# Altium project Motor42_Foc.PrjPcb
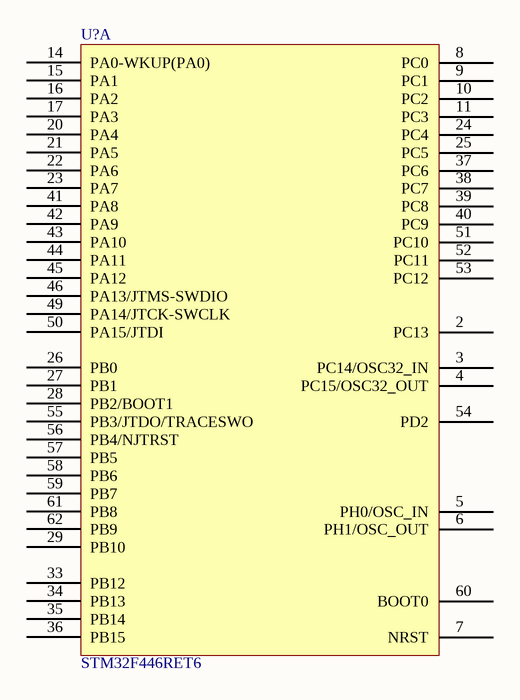
[diagram p0: MCU.SchDoc]
2 sheets, 19 parts. Net scope: flat (ports and power ports of the same name join across sheets).
Board file: Motor42_Foc.PcbDoc
Sheets:
  MCU.SchDoc
  MOTOR.SchDoc

## Sheet MCU.SchDoc
size A4; SheetNumber: 1; SheetTotal: 2

### Parts
(Parts that share a designator on the sheet are numbered #1, #2 ... from top to bottom, then left to right.)
U?#1  STM32F446RET6  [LQFP-64_10x10_P0.5]  (part A of 2)

### Nets

Not connected (* = marked no-connect by the designer): U?#1 2(PC13) 3(PC14/OSC32_IN) 4(PC15/OSC32_OUT) 5(PH0/OSC_IN) 6(PH1/OSC_OUT) 7(NRST) 8(PC0) 9(PC1) 10(PC2) 11(PC3) 14(PA0-WKUP(PA0)) 15(PA1) 16(PA2) 17(PA3) 20(PA4) 21(PA5) 22(PA6) 23(PA7) 24(PC4) 25(PC5) 26(PB0) 27(PB1) 28(PB2/BOOT1) 29(PB10) 33(PB12) 34(PB13) 35(PB14) 36(PB15) 37(PC6) 38(PC7) 39(PC8) 40(PC9) 41(PA8) 42(PA9) 43(PA10) 44(PA11) 45(PA12) 46(PA13/JTMS-SWDIO) 49(PA14/JTCK-SWCLK) 50(PA15/JTDI) 51(PC10) 52(PC11) 53(PC12) 54(PD2) 55(PB3/JTDO/TRACESWO) 56(PB4/NJTRST) 57(PB5) 58(PB6) 59(PB7) 60(BOOT0) 61(PB8) 62(PB9)

### Library data of the parts
U?#1 = STM32F446RET6: Suppiler: 立创商城; Suppiler Number: C69336; Vendor: ST(意法半导体); Component Type: STM32F446RET6; ComponentLink2Description: Datasheet; LatestRevisionDate: 2025-08-06

## Sheet MOTOR.SchDoc
size A4; SheetNumber: 2; SheetTotal: 2
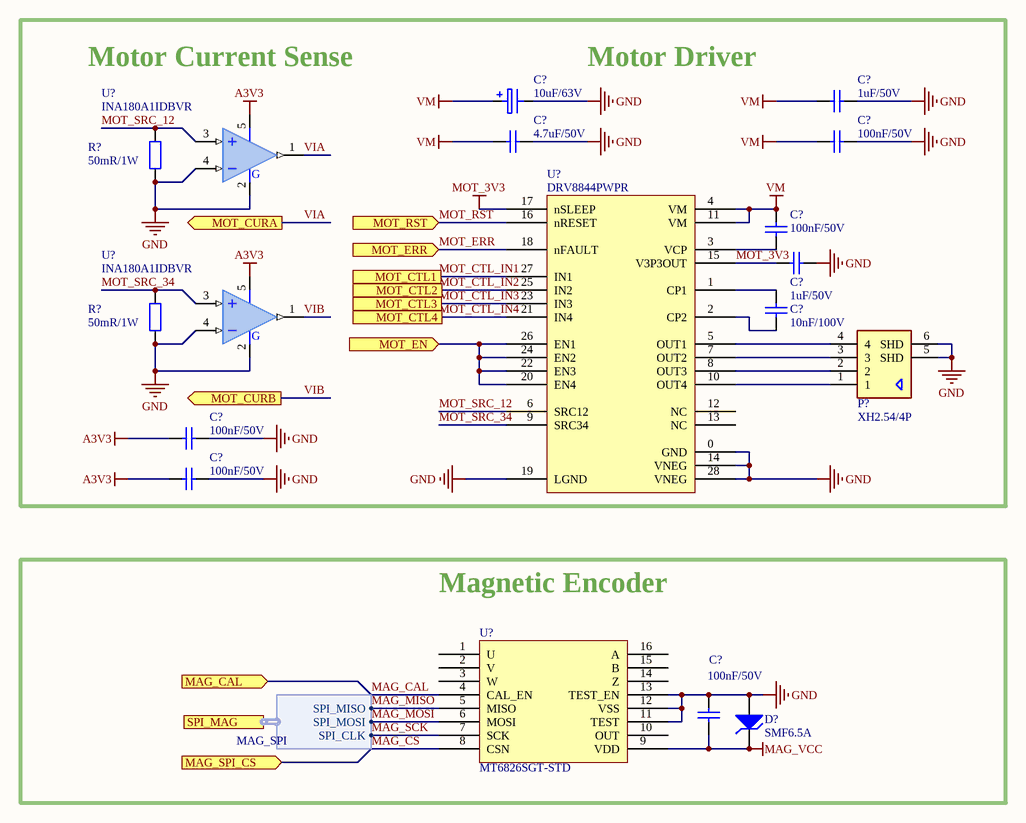
[diagram p1: MOTOR.SchDoc]

### Parts
(Parts that share a designator on the sheet are numbered #1, #2 ... from top to bottom, then left to right.)
C?#1  10uF/63V  [CAP_ELE_POLYMER_SMD_D6.3*L5.8]
C?#2  1uF/50V  [C1206]
C?#3  4.7uF/50V  [C1206]
C?#4  100nF/50V  [C0805]
C?#5  100nF/50V  [C0603]
C?#6  1uF/50V  [C0603]
C?#7  10nF/100V  [C0603]
C?#8  100nF/50V  [C0603]
C?#9  100nF/50V  [C0603]
C?#10  100nF/50V  [C0603]
D?  SMF6.5A  [SOD-123FL_TVS_UNI]
P?  XH2.54/4P  [XH2.54-4P_WT_SMT_L15.0*W7.8*H6.0]
R?#1  50mR/1W  [R1206]
R?#2  50mR/1W  [R1206]
U?#2  INA180A1IDBVR  [SOT-23-5]
U?#3  DRV8844PWPR  [TSSOP-28-EP_L9.8*W4.5_P0.65_EP5.62*2.94]
U?#4  INA180A1IDBVR  [SOT-23-5]
U?#5  MT6826SGT-STD  [TSSOP-16]

### Blocks framed on the sheet
Magnetic Encoder: C?#10 D? U?#5

### Ports
MAG_CAL (in), MAG_SPI_CS (in), MOT_CTL1 (in), MOT_CTL2 (in), MOT_CTL3 (in), MOT_CTL4 (in), MOT_CURA (out), MOT_CURB (out), MOT_EN (in), MOT_ERR (in), MOT_RST (in), SPI_MAG (harness MAG_SPI)

### Harnesses
MAG_SPI: SPI_MISO, SPI_MOSI, SPI_CLK

### Nets
A3V3: C?#8.1 C?#9.1 U?#2.5(VS) U?#4.5(VS)
GND: C?#1.2 C?#2.2 C?#3.2 C?#4.2 C?#6.1 C?#8.2 C?#9.2 C?#10.2 D?.1(ANODE) P?.5(SHD) P?.6(SHD) R?#1.1 R?#2.1 U?#2.2(GND) U?#2.4(IN-) U?#3.0(GND) U?#3.14(VNEG) U?#3.19(LGND) U?#3.28(VNEG) U?#4.2(GND) U?#4.4(IN-) U?#5.11(TEST) U?#5.12(VSS) U?#5.13(TEST_EN)
MAG_VCC: C?#10.1 D?.2(CATHODE) U?#5.9(VDD)
MOT_3V3: C?#6.2 U?#3.15(V3P3OUT) U?#3.17(nSLEEP)
VM: C?#1.1 C?#2.1 C?#3.1 C?#4.1 C?#5.1 U?#3.4(VM) U?#3.11(VM)
MAG_CAL: U?#5.4(CAL_EN) ; port MAG_CAL
MAG_CS: U?#5.8(CSN) ; port MAG_SPI_CS
MAG_MISO: U?#5.5(MISO) ; port SPI_MAG.SPI_MISO
MAG_MOSI: U?#5.6(MOSI) ; port SPI_MAG.SPI_MOSI
MAG_SCK: U?#5.7(SCK) ; port SPI_MAG.SPI_CLK
MOT_CTL_IN1: U?#3.27(IN1) ; port MOT_CTL1
MOT_CTL_IN2: U?#3.25(IN2) ; port MOT_CTL2
MOT_CTL_IN3: U?#3.23(IN3) ; port MOT_CTL3
MOT_CTL_IN4: U?#3.21(IN4) ; port MOT_CTL4
MOT_ERR: U?#3.18(nFAULT) ; port MOT_ERR
MOT_RST: U?#3.16(nRESET) ; port MOT_RST
MOT_SRC_12: R?#1.2 U?#2.3(IN+) U?#3.6(SRC12)
MOT_SRC_34: R?#2.2 U?#3.9(SRC34) U?#4.3(IN+)
VIA: U?#2.1(OUT) ; port MOT_CURA
VIB: U?#4.1(OUT) ; port MOT_CURB
NetC?#5_2: C?#5.2 U?#3.3(VCP)
NetC?#7_1: C?#7.1 U?#3.2(CP2)
NetC?#7_2: C?#7.2 U?#3.1(CP1)
NetP?_1: P?.1 U?#3.10(OUT4)
NetP?_2: P?.2 U?#3.8(OUT3)
NetP?_3: P?.3 U?#3.7(OUT2)
NetP?_4: P?.4 U?#3.5(OUT1)
NetU?#3_20: U?#3.20(EN4) U?#3.22(EN3) U?#3.24(EN2) U?#3.26(EN1) ; port MOT_EN

Not connected (* = marked no-connect by the designer): U?#3 12(NC) 13(NC); U?#5 1(U) 2(V) 3(W) 10(OUT) 14(Z) 15(B) 16(A)

### Notes on the sheet
- Motor Current Sense
- Motor Driver
- (in symbol INA180A1IDBVR) G

### Library data of the parts
C?#1 = HV1J106M0605PZ: Vendor: HONOR(荣誉); Tolerance: ±20%; Type: Polymer; Suppiler: 立创商城; Suppiler Number: C5246566; Published: 8-Jun-2000; LatestRevisionDate: 2025/8/11; LatestRevisionNote: Re-released for DXP Platform.; PackageReference: RB7.6-15; Publisher: Altium Limited; Value: 10uF/63V; Component Type: HV1J106M0605PZ; ComponentLink2Description: DataSheet
C?#2-C?#10 = Cap: Capacitor; Value: 0.1uF; Published: 8-Jun-2000; LatestRevisionDate: 17-Jul-2002; LatestRevisionNote: Re-released for DXP Platform.; PackageReference: RAD-0.3; Publisher: Altium Limited
D? = SMF6.5A: Vendor: Littelfuse(美国力特); Type: TVS; Suppiler: 立创商城; Suppiler Number: C720056; Component Type: SMF6.5A; ComponentLink2Description: DataSheet; LatestRevisionDate: 2025/8/7
P? = WAFER-XH2.54-4PWB: SMD,P=2.5mm,4P,卧贴; Vendor: XUNPU(讯普); Suppiler: 立创商城; Suppiler Number: C3029478; Component Type: WAFER-XH2.54-4PWB; Type: XH2.54/4P; ComponentLink2Description: DataSheet; LatestRevisionDate: 2025/8/8
R?#1 R?#2 = HoYH1206-1W-50mR-1%: Vendor: Milliohm(毫欧); Tolerance: ±1%; Suppiler: 立创商城; Suppiler Number: C601088; Published: 8-Jun-2000; LatestRevisionDate: 2025/8/11; LatestRevisionNote: Re-released for DXP Platform.; PackageReference: AXIAL-0.4; Publisher: Altium Limited; Value: 50mR/1W; Component Type: HoYH1206-1W-50mR-1%; Type: 1206/1W; ComponentLink2Description: DataSheet
U?#2 U?#4 = INA180A1IDBVR: low and high side voltage Output,Currrent Sense Amplifiers,Gain=20V/V.; Vendor: TI(德州仪器); Suppiler: 立创商城; Suppiler Number: C122228; Component Type: INA180A1IDBVR; Type: Current Sense Amplifiers; ComponentLink2Description: DataSheet; LatestRevisionDate: 2025/8/11
U?#3 = DRV8844PWPR: Quad 1/2 H-Bridge Driver IC; Vendor: TI(德州仪器); Suppiler: 立创商城; Suppiler Number: C177807; Component Type: DRV8844PWPR; ComponentLink2Description: DataSheet; LatestRevisionDate: 2025/8/8
U?#5 = MT6826SGT-STD: 15位高分辨率、高精度磁性角度编码器IC; Vendor: MagnTek（麦歌恩）; Suppiler: 立创商城; Suppiler Number: C27636731; Component Type: MT6826SGT-STD; ComponentLink2Description: DataSheet; LatestRevisionDate: 2025/8/7